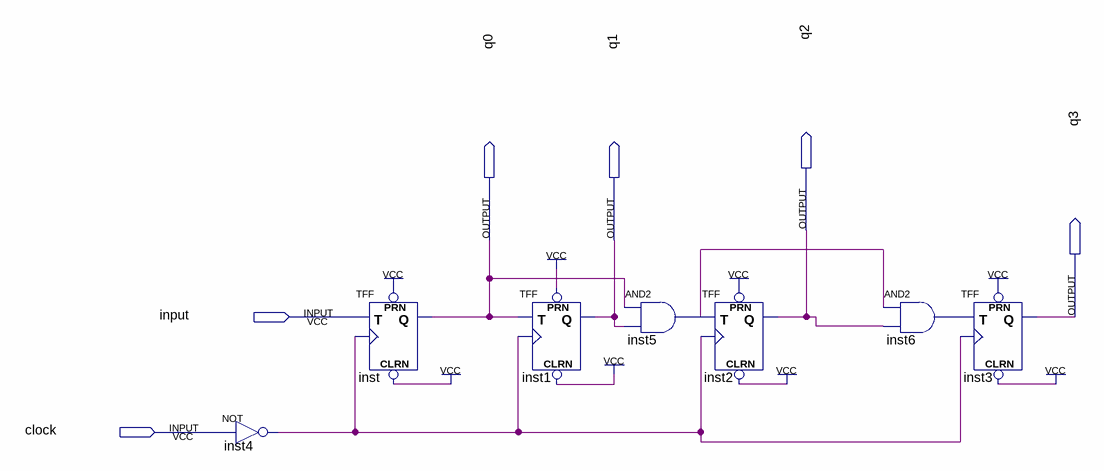
[diagram p0: schematic sheet]
// Quartus schematic lab10step2b.bdf as structural Verilog: 7 symbols, 6 pins
module lab10step2b (
  input  \input ,
  input  clock,
  output q2,
  output q0,
  output q1,
  output q3
);

  wire inst4_out, inst5_out, inst6_out;

  not inst4 (inst4_out, clock);
  TFF inst (.PRN(1'b1), .CLRN(1'b1), .T(\input ), .CLK(inst4_out), .Q(q0));
  TFF inst1 (.PRN(1'b1), .CLRN(1'b1), .T(q0), .CLK(inst4_out), .Q(q1));
  and inst5 (inst5_out, q0, q1);
  TFF inst2 (.PRN(1'b1), .CLRN(1'b1), .T(inst5_out), .CLK(inst4_out), .Q(q2));
  and inst6 (inst6_out, inst5_out, q2);
  TFF inst3 (.PRN(1'b1), .CLRN(1'b1), .T(inst6_out), .CLK(inst4_out), .Q(q3));
endmodule
